# Altium project XXXX.468323.001 Драйвер бесколлекторного мотора.PrjPcb
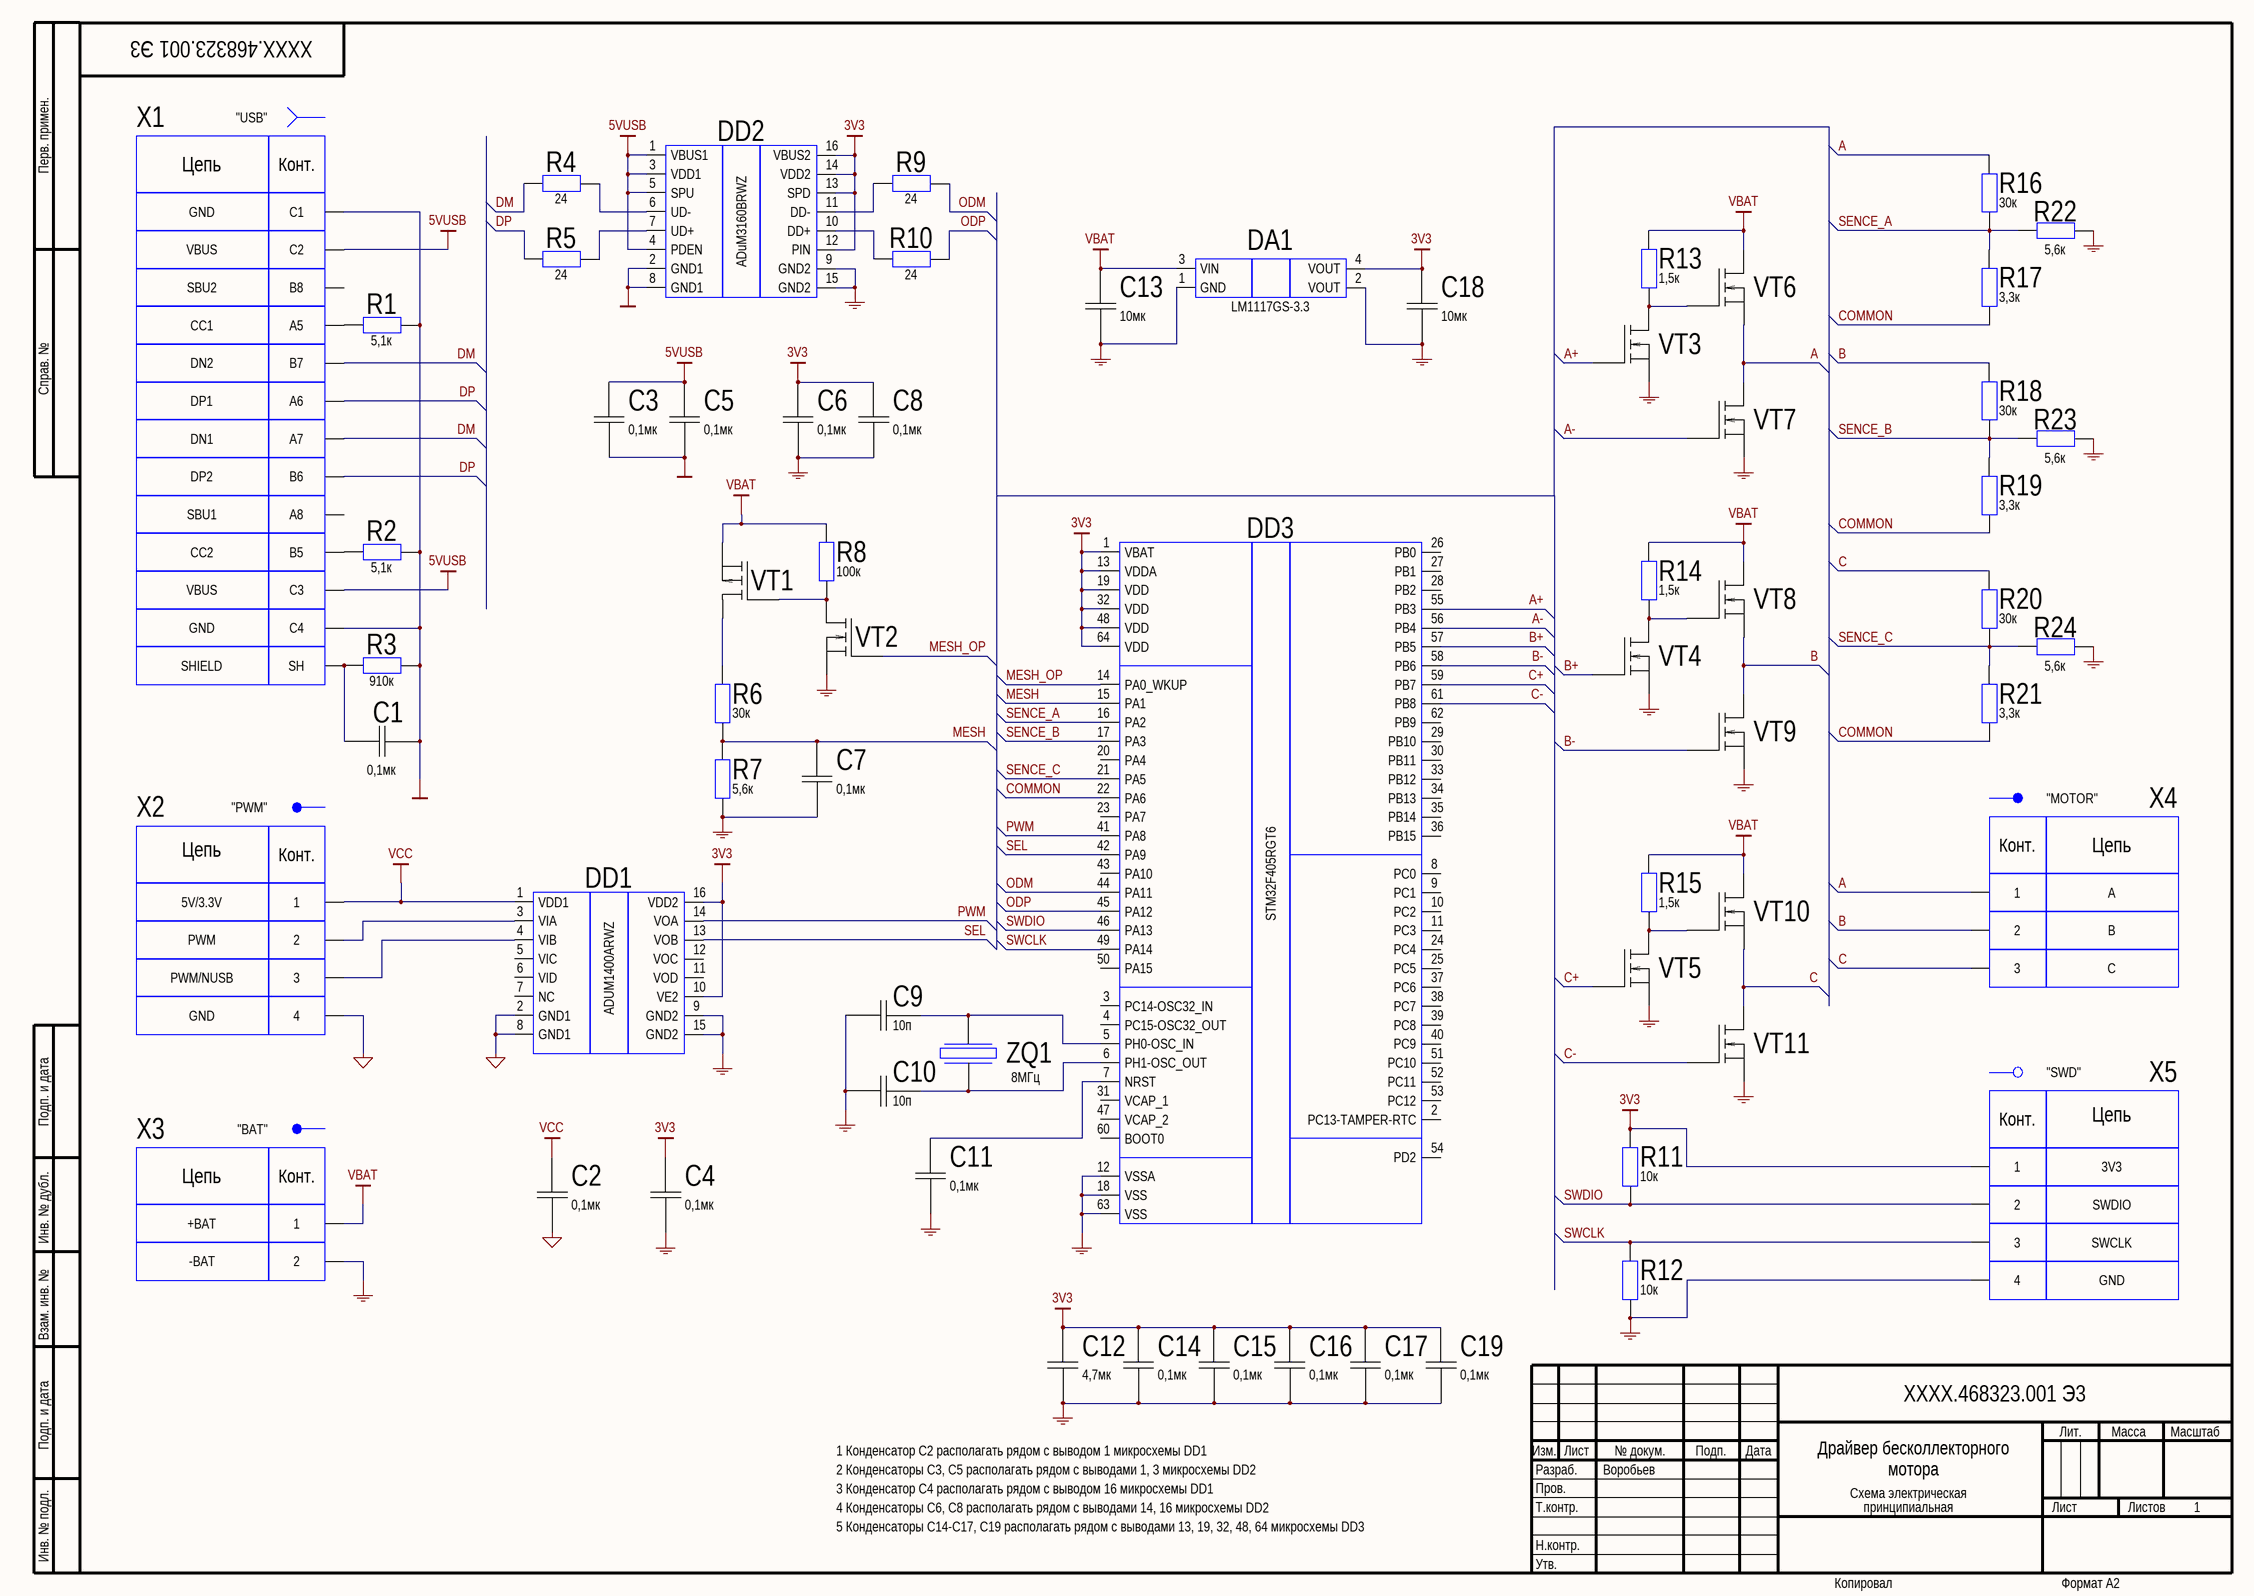
[diagram p0: XXXX.468323.001 Э3 Драйвер бесколлекторного мотора. Схема электрическая принципиальная.SchDoc]
1 sheet, 64 parts. Net scope: global (net labels, ports and power ports of the same name join across sheets).

## Sheet XXXX.468323.001 Э3 Драйвер бесколлекторного мотора. Схема электрическая принципиальная.SchDoc
size 594 x 420 mm; SheetNumber: 1; SheetTotal: 1; Разраб.: Воробьев; Обозначение документа: XXXX.468323.001 Э3; Общее количество листов: 1; Наименование изделия 2: Схема электрическая; Наименование изделия 3: принципиальная

### Parts
C1  0,1мк  [CAPC1608X06L]
C2  0,1мк  [CAPC1608X06L]
C3  0,1мк  [CAPC1608X06L]
C4  0,1мк  [CAPC1608X06L]
C5  0,1мк  [CAPC1608X06L]
C6  0,1мк  [CAPC1608X06L]
C7  0,1мк  [CAPC1608X06L]
C8  0,1мк  [CAPC1608X06L]
C9  10п  [CAPC1608X06L]
C10  10п  [CAPC1608X06L]
C11  0,1мк  [CAPC1608X06L]
C12  4,7мк  [CAPC1608X06L]
C13  10мк  [CAPC3225X28N]
C14  0,1мк  [CAPC1608X06L]
C15  0,1мк  [CAPC1608X06L]
C16  0,1мк  [CAPC1608X06L]
C17  0,1мк  [CAPC1608X06L]
C18  10мк  [CAPC1608X06L]
C19  0,1мк  [CAPC1608X06L]
DA1  LM1117GS-3.3  [SOT230P700X180-4N]
DD1  ADUM1400ARWZ  [SOP127P1030X265-16N]
DD2  ADuM3160BRWZ  [SOP127P1030X265-16N]
DD3  STM32F405RGT6  [TSQFP50P1200X1200X160-64N]
R1  5,1к  [RESC1608X06M]
R2  5,1к  [RESC1608X06M]
R3  910к  [RESC1608X06M]
R4  24  [RESC1608X06M]
R5  24  [RESC1608X06M]
R6  30к  [RESC1608X06M]
R7  5,6к  [RESC1608X06M]
R8  100к  [RESC1608X06M]
R9  24  [RESC1608X06M]
R10  24  [RESC1608X06M]
R11  10к  [RESC1608X06M]
R12  10к  [RESC1608X06M]
R13  1,5к  [RESC1608X06M]
R14  1,5к  [RESC1608X06M]
R15  1,5к  [RESC1608X06M]
R16  30к  [RESC1608X06M]
R17  3,3к  [RESC1608X06M]
R18  30к  [RESC1608X06M]
R19  3,3к  [RESC1608X06M]
R20  30к  [RESC1608X06M]
R21  3,3к  [RESC1608X06M]
R22  5,6к  [RESC1608X06M]
R23  5,6к  [RESC1608X06M]
R24  5,6к  [RESC1608X06M]
VT1  AO3401A  [SOT95P240X115-3N]  (value not drawn)
VT2  IRLML0040TRPBF  [SOT95P240X115-3N]  (value not drawn)
VT3  IRLML0040TRPBF  [SOT95P240X115-3N]  (value not drawn)
VT4  IRLML0040TRPBF  [SOT95P240X115-3N]  (value not drawn)
VT5  IRLML0040TRPBF  [SOT95P240X115-3N]  (value not drawn)
VT6  P0603BD  [DPAK228P966X250-3N]  (value not drawn)
VT7  P0603BD  [DPAK228P966X250-3N]  (value not drawn)
VT8  P0603BD  [DPAK228P966X250-3N]  (value not drawn)
VT9  P0603BD  [DPAK228P966X250-3N]  (value not drawn)
VT10  P0603BD  [DPAK228P966X250-3N]  (value not drawn)
VT11  P0603BD  [DPAK228P966X250-3N]  (value not drawn)
X1  "USB"  [USB3.1 TYPE-C 16PF-015]
X2  "PWM"  NETName4: GND  NETName3: PWM/NUSB  NETName2: PWM  NETName1: 5V/3.3V  [Pads 4x2.54]
X3  "BAT"  NETName2: -BAT  NETName1: +BAT  [Pads 2x2.54]
X4  "MOTOR"  NETName3: C  NETName2: B  NETName1: A  [Pads 3x2.54]
X5  "SWD"  NETName4: GND  NETName3: SWCLK  NETName2: SWDIO  NETName1: 3V3  [Pads 4x2.54]
ZQ1  8МГц  [HC49/S]

### Nets
3V3: C4.1 C6.1 C8.1 C12.1 C14.1 C15.1 C16.1 C17.1 C18.1 C19.1 DA1.4(VOUT) DD1.10(VE2) DD1.16(VDD2) DD2.12(PIN) DD2.13(SPD) DD2.14(VDD2) DD2.16(VBUS2) DD3.1(VBAT) DD3.13(VDDA) DD3.19(VDD) DD3.32(VDD) DD3.48(VDD) DD3.64(VDD) R11.2 X5.1
5VUSB: C3.1 C5.1 DD2.1(VBUS1) DD2.3(VDD1) DD2.4(PDEN) DD2.5(SPU) X1.C2 X1.C3
GND: C1.2 C2.2 C3.2 C4.2 C5.2 C6.2 C7.2 C8.2 C9.1 C10.1 C11.2 C12.2 C13.2 C14.2 C15.2 C16.2 C17.2 C18.2 C19.2 DA1.1(GND) DA1.2(VOUT) DD1.2(GND1) DD1.8(GND1) DD1.9(GND2) DD1.15(GND2) DD2.2(GND1) DD2.8(GND1) DD2.9(GND2) DD2.15(GND2) DD3.12(VSSA) DD3.18(VSS) DD3.63(VSS) R1.2 R2.2 R3.2 R7.1 R12.1 R22.1 R23.1 R24.1 VT2.2(S) VT3.2(S) VT4.2(S) VT5.2(S) VT7.3(S) VT9.3(S) VT11.3(S) X1.C1 X1.C4 X2.4 X3.2 X5.4
VBAT: C13.1 DA1.3(VIN) R8.2 R13.2 R14.2 R15.2 VT1.2(S) VT6.4(D) VT8.4(D) VT10.4(D) X3.1
VCC: C2.1 DD1.1(VDD1) X2.1
A: R16.2 VT6.3(S) VT7.4(D) X4.1
A+: DD3.55(PB3) VT3.1(G)
A-: DD3.56(PB4) VT7.1(G)
B: R18.2 VT8.3(S) VT9.4(D) X4.2
B+: DD3.57(PB5) VT4.1(G)
B-: DD3.58(PB6) VT9.1(G)
C: R20.2 VT10.3(S) VT11.4(D) X4.3
C+: DD3.59(PB7) VT5.1(G)
C-: DD3.61(PB8) VT11.1(G)
COMMON: DD3.22(PA6) R17.1 R19.1 R21.1
DM: R4.1 X1.A7 X1.B7
DP: R5.1 X1.A6 X1.B6
MESH: C7.1 DD3.15(PA1) R6.1 R7.2
MESH_OP: DD3.14(PA0_WKUP) VT2.1(G)
ODM: DD3.44(PA11) R9.2
ODP: DD3.45(PA12) R10.2
PWM: DD1.14(VOA) DD3.41(PA8)
SEL: DD1.13(VOB) DD3.42(PA9)
SENCE_A: DD3.16(PA2) R16.1 R17.2 R22.2
SENCE_B: DD3.17(PA3) R18.1 R19.2 R23.2
SENCE_C: DD3.21(PA5) R20.1 R21.2 R24.2
SWCLK: DD3.49(PA14) R12.2 X5.3
SWDIO: DD3.46(PA13) R11.1 X5.2
NetC1_1: C1.1 R3.1 X1.SHIELD
NetC9_2: C9.2 DD3.5(PH0-OSC_IN) ZQ1.1
NetC10_2: C10.2 DD3.6(PH1-OSC_OUT) ZQ1.2
NetC11_1: C11.1 DD3.7(NRST)
NetDD1_3: DD1.3(VIA) X2.2
NetDD1_4: DD1.4(VIB) X2.3
NetDD2_6: DD2.6(UD-) R4.2
NetDD2_7: DD2.7(UD+) R5.2
NetDD2_10: DD2.10(DD+) R10.1
NetDD2_11: DD2.11(DD-) R9.1
NetR1_1: R1.1 X1.A5
NetR2_1: R2.1 X1.B5
NetR6_2: R6.2 VT1.3(D)
NetR8_1: R8.1 VT1.1(G) VT2.3(D)
NetR13_1: R13.1 VT3.3(D) VT6.1(G)
NetR14_1: R14.1 VT4.3(D) VT8.1(G)
NetR15_1: R15.1 VT5.3(D) VT10.1(G)

Not connected (* = marked no-connect by the designer): DD1 5(VIC) 6(VID) 7(NC) 11(VOD) 12(VOC); DD3 2(PC13-TAMPER-RTC) 3(PC14-OSC32_IN) 4(PC15-OSC32_OUT) 8(PC0) 9(PC1) 10(PC2) 11(PC3) 20(PA4) 23(PA7) 24(PC4) 25(PC5) 26(PB0) 27(PB1) 28(PB2) 29(PB10) 30(PB11) 31(VCAP_1) 33(PB12) 34(PB13) 35(PB14) 36(PB15) 37(PC6) 38(PC7) 39(PC8) 40(PC9) 43(PA10) 47(VCAP_2) 50(PA15) 51(PC10) 52(PC11) 53(PC12) 54(PD2) 60(BOOT0) 62(PB9); X1 A8 B8

### Notes on the sheet
- 1 Конденcатор C2 располагать рядом с выводом 1 микросхемы DD1
- 2 Конденcаторы C3, C5 располагать рядом с выводами 1, 3 микросхемы DD2
- 4 Конденcаторы C6, C8 располагать рядом с выводами 14, 16 микросхемы DD2
- 3 Конденcатор C4 располагать рядом с выводом 16 микросхемы DD1
- Драйвер бесколлекторного мотора
- 5 Конденcаторы С14-С17, С19 располагать рядом с выводами 13, 19, 32, 48, 64 микросхемы DD3
- Перв. примен.
- Справ. №
- Подп. и дата
- Инв. № дубл.
- Взам. инв. №
- Разраб.
- Изм.
- Лист
- № докум.
- Подп.
- Дата
- Лит.
- Масса
- Масштаб
- Пров.
- Т.контр.
- Листов
- Инв. № подл.
- Утв.
- Н.контр.
- Копировал
- Формат А2
- (in symbol pads 2x2,54) Цепь; Конт.
- (in symbol pads 3x2,54) Конт.; Цепь
- (in symbol pads 4x2,54) Цепь; Конт.
- (in symbol USB3.1 TYPE-C 16PF-015) Цепь; Конт.; GND; VBUS; SBU2; CC1; DN2; DP1; DN1; DP2; SBU1; CC2; SH

### Library data of the parts
C1-C8 C11 C14-C17 C19 = CC0603KRX7R9BB104: SMD0603 X7R 50 В, 0,1мкФ±10% CC0603KRX7R9BB104; Voltage: 50 В; Value: 0,1; Multiplier: мкФ; Tolerance: 10%; Part Number: CC0603KRX7R9BB104; Isolator: X7R
C9 C10 = CC0603JRNPO9BN100: SMD0603 NPO 50 В, 10пФ±5% CC0603JRNPO9BN100; Voltage: 50 В; Value: 10; Multiplier: пФ; Tolerance: 5%; Part Number: CC0603JRNPO9BN100; Isolator: NPO
C12 = CC0603KRX5R5BB475: SMD0603 X5R 6,3 В, 4,7мкФ±10% CC0603KRX5R5BB475; Voltage: 6,3 В; Value: 4,7; Multiplier: мкФ; Tolerance: 10%; Part Number: CC0603KRX5R5BB475; Isolator: X5R
C13 = CC1210ZKY5V9BB106: SMD1210 Y5R 50 В, 10мкФ±-20/+80% CC1210ZKY5V9BB106; Voltage: 50 В; Value: 10; Multiplier: мкФ; Part Number: CC1210ZKY5V9BB106; Isolator: Y5R; Tolerance: -20/+80%
C18 = CC0603KRX5R6BB106: SMD0603 X5R 10 В, 10мкФ±10% CC0603KRX5R6BB106; Voltage: 10 В; Value: 10; Multiplier: мкФ; Tolerance: 10%; Part Number: CC0603KRX5R6BB106; Isolator: X5R
DA1 = LM1117GS-3.3: Descriptiom: Линейный стабилизатор с малым падением напряжения 3,3В, 1А LM1117GS-3.3; Part Number: LM1117GS-3.3
DD1 = ADUM1400ARWZ: Descriptiom: Микросхема гальванической развязки ADUM1400ARWZ; Part Number: ADUM1400ARWZ
DD2 = ADuM3160BRWZ: Descriptiom: Микросхема гальванической развязки интерфеса USB High/Low Speed ADuM3160BRWZ; Part Number: ADuM3160BRWZ
DD3 = STM32F405RGT6: Descriptiom: Микроконтроллер STM32F405RGT6; Part Number: STM32F405RGT6
R1 R2 = RC0603FR-075K1L: SMD0603 0,1 Вт, 5,1 кОм±1% RC0603FR-075K1L; Value: 5,1; Multiplier: кОм; Tolerance: 1%; Power: 0,1 Вт; Part Number: RC0603FR-075K1L; Datasheet: ..\Datasheets\Passives\Resistors\PYu_RC_Group_51_RoHS_L_11-1984063.pdf
R3 = RC0603FR-07910KL: SMD0603 0,1 Вт, 910 кОм±1% RC0603FR-07910KL; Value: 910; Multiplier: кОм; Tolerance: 1%; Power: 0,1 Вт; Part Number: RC0603FR-07910KL; Datasheet: ..\Datasheets\Passives\Resistors\PYu_RC_Group_51_RoHS_L_11-1984063.pdf
R4 R5 R9 R10 = RC0603FR-0724RL: SMD0603 0,1 Вт, 24 Ом±1% RC0603FR-0724RL; Multiplier: Ом; Tolerance: 1%; Power: 0,1 Вт; Part Number: RC0603FR-0724RL; Value: 24; Datasheet: ..\Datasheets\Passives\Resistors\PYu_RC_Group_51_RoHS_L_11-1984063.pdf
R6 R16 R18 R20 = RC0603FR-0730KL: SMD0603 0,1 Вт, 30 кОм±1% RC0603FR-0730KL; Value: 30; Multiplier: кОм; Tolerance: 1%; Power: 0,1 Вт; Part Number: RC0603FR-0730KL; Datasheet: ..\Datasheets\Passives\Resistors\PYu_RC_Group_51_RoHS_L_11-1984063.pdf
R7 R22-R24 = RC0603FR-075K6L: SMD0603 0,1 Вт, 5,6 кОм±1% RC0603FR-075K6L; Value: 5,6; Multiplier: кОм; Tolerance: 1%; Power: 0,1 Вт; Part Number: RC0603FR-075K6L; Datasheet: ..\Datasheets\Passives\Resistors\PYu_RC_Group_51_RoHS_L_11-1984063.pdf
R8 = RC0603FR-07100KL: SMD0603 0,1 Вт, 100 кОм±1% RC0603FR-07100KL; Value: 100; Multiplier: кОм; Tolerance: 1%; Power: 0,1 Вт; Part Number: RC0603FR-07100KL; Datasheet: ..\Datasheets\Passives\Resistors\PYu_RC_Group_51_RoHS_L_11-1984063.pdf
R11 R12 = RC0603FR-0710KL: SMD0603 0,1 Вт, 10 кОм±1% RC0603FR-0710KL; Value: 10; Multiplier: кОм; Tolerance: 1%; Power: 0,1 Вт; Part Number: RC0603FR-0710KL; Datasheet: ..\Datasheets\Passives\Resistors\PYu_RC_Group_51_RoHS_L_11-1984063.pdf
R13-R15 = RC0603FR-071K5L: SMD0603 0,1 Вт, 1,5 кОм±1% RC0603FR-071K5L; Value: 1,5; Multiplier: кОм; Tolerance: 1%; Power: 0,1 Вт; Part Number: RC0603FR-071K5L; Datasheet: ..\Datasheets\Passives\Resistors\PYu_RC_Group_51_RoHS_L_11-1984063.pdf
R17 R19 R21 = RC0603FR-073K3L: SMD0603 0,1 Вт, 3,3 кОм±1% RC0603FR-073K3L; Value: 3,3; Multiplier: кОм; Tolerance: 1%; Power: 0,1 Вт; Part Number: RC0603FR-073K3L; Datasheet: ..\Datasheets\Passives\Resistors\PYu_RC_Group_51_RoHS_L_11-1984063.pdf
VT1 = AO3401A: Descriptiom: С индуцированным P-каналом -30 В, -4,0 А AO3401A; Part Number: AO3401A
VT2-VT5 = IRLML0040TRPBF: Descriptiom: С индуцированным N-каналом 40 В, 3,6 А IRLML0040TRPBF; Part Number: IRLML0040TRPBF
VT6-VT11 = P0603BD: Descriptiom: С индуцированным N-каналом 30 В, 70 А P0603BD; Part Number: P0603BD
X1 = USB3.1 TYPE-C 16PF-015: Разъём USB Type C USB3.1 TYPE-C 16PF-015; Part Number: USB3.1 TYPE-C 16PF-015
X2 X5 = pads 4x2,54: Part Number: pads 4x2,54
X3 = pads 2x2,54: Part Number: pads 2x2,54
X4 = pads 3x2,54: Part Number: pads 3x2,54
ZQ1 = L-KLS14-HC-49S-8.000-16-30-C: Descriptiom: Кварцевый резонатор 8 МГц L-KLS14-HC-49S-8.000-16-30-C; Part Number: L-KLS14-HC-49S-8.000-16-30-C